# EAGLE design Heep32U4 (EAGLE 7.3.0)
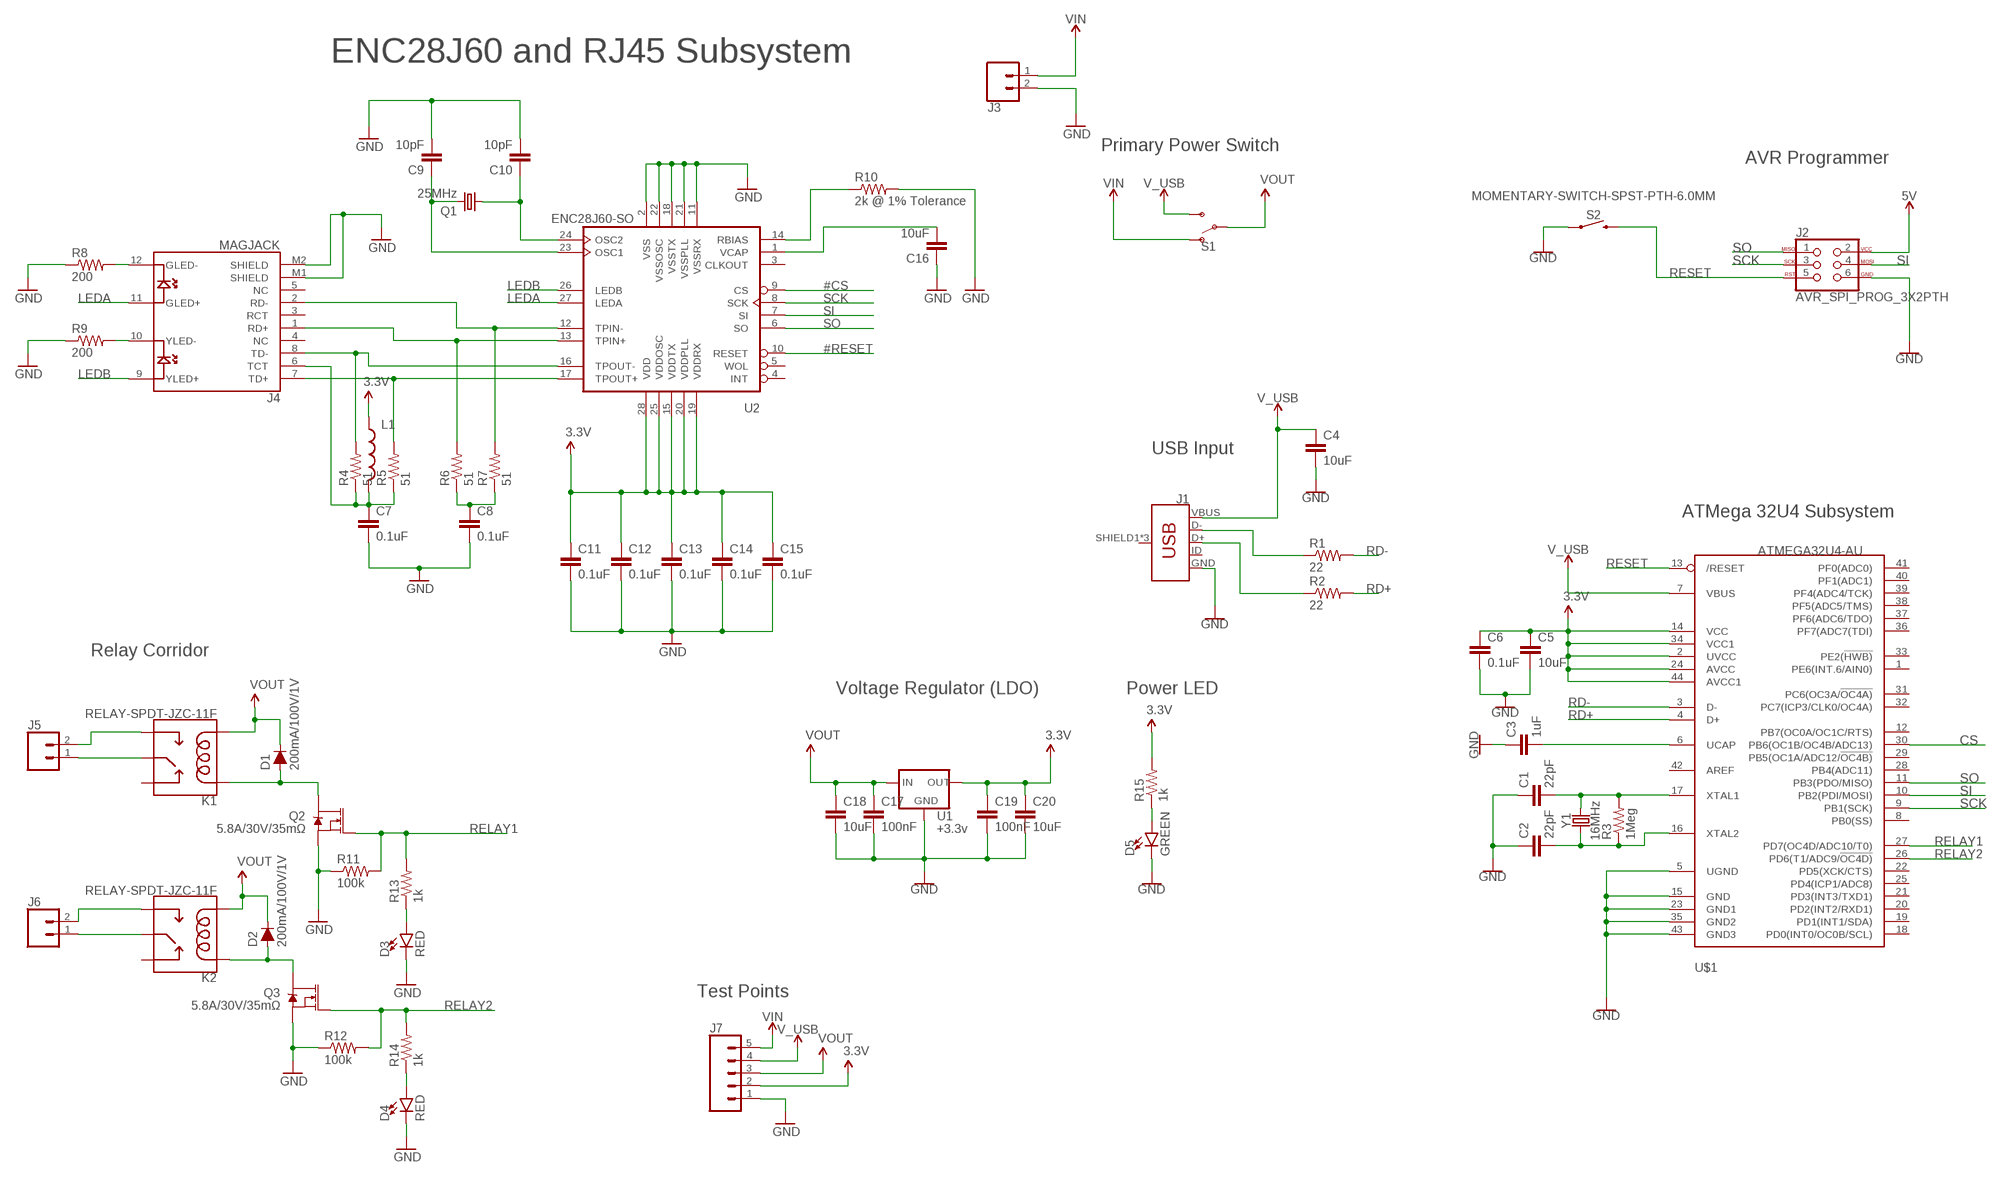
[diagram p0: schematic, sheet 1]

## Parts
C1  22pF  CAP0603-CAP  [0603-CAP]
C2  22pF  CAP0603-CAP  [0603-CAP]
C3  1uF  CAP0603-CAP  [0603-CAP]
C4  10uF  CAP0603-CAP  [0603-CAP]
C5  10uF  CAP0603-CAP  [0603-CAP]
C6  0.1uF  CAP0603-CAP  [0603-CAP]
C7  0.1uF  CAP0603-CAP  [0603-CAP]
C8  0.1uF  CAP0603-CAP  [0603-CAP]
C9  10pF  CAP0603-CAP  [0603-CAP]
C10  10pF  CAP0603-CAP  [0603-CAP]
C11  0.1uF  CAP0603-CAP  [0603-CAP]
C12  0.1uF  CAP0603-CAP  [0603-CAP]
C13  0.1uF  CAP0603-CAP  [0603-CAP]
C14  0.1uF  CAP0603-CAP  [0603-CAP]
C15  0.1uF  CAP0603-CAP  [0603-CAP]
C16  10uF  CAP0603-CAP  [0603-CAP]
C17  100nF  CAP0603-CAP  [0603-CAP]
C18  10uF  CAP0603-CAP  [0603-CAP]
C19  100nF  CAP0603-CAP  [0603-CAP]
C20  10uF  CAP0603-CAP  [0603-CAP]
D1  200mA/100V/1V  DIODE-1N4148  [DIODE-1N4148]
D2  200mA/100V/1V  DIODE-1N4148  [DIODE-1N4148]
D3  RED  LED-RED0603  [LED-0603]
D4  RED  LED-RED0603  [LED-0603]
D5  GREEN  LED-GREEN0603  [LED-0603]
J1  USB_MICRO-B_FEMALE-SMT  [USB-B-MICRO-SMD]
J2  AVR_SPI_PROG_3X2PTH  [2X3]
J3  CONN_02  [1X02]
J4  MAGJACK  [MAGJACK]
J5  CONN_025MM  [SCREWTERMINAL-5MM-2]
J6  CONN_025MM  [SCREWTERMINAL-5MM-2]
J7  CONN_05  [1X05]
K1  RELAY-SPDT-JZC-11F  [RELAY-JZC]
K2  RELAY-SPDT-JZC-11F  [RELAY-JZC]
L1  INDUCTOR0603  [0603]
Q1  25MHz  CRYSTALSM49  [SM49]
Q2  5.8A/30V/35mΩ  MOSFET-NCH-AO3404A  [SOT23-3]
Q3  5.8A/30V/35mΩ  MOSFET-NCH-AO3404A  [SOT23-3]
R1  22  RESISTOR0603-RES  [0603-RES]
R2  22  RESISTOR0603-RES  [0603-RES]
R3  1Meg  RESISTOR0603-RES  [0603-RES]
R4  51  RESISTOR0603  [0603-RES]
R5  51  RESISTOR0603  [0603-RES]
R6  51  RESISTOR0603  [0603-RES]
R7  51  RESISTOR0603  [0603-RES]
R8  200  RESISTOR0603  [0603-RES]
R9  200  RESISTOR0603  [0603-RES]
R10  2k @ 1% Tolerance  RESISTOR0603-RES  [0603-RES]
R11  100k  RESISTOR0603-RES  [0603-RES]
R12  100k  RESISTOR0603-RES  [0603-RES]
R13  1k  RESISTOR0603-RES  [0603-RES]
R14  1k  RESISTOR0603-RES  [0603-RES]
R15  1k  RESISTOR0603-RES  [0603-RES]
S1  SWITCH-SPDT-PTH-11.6X4.0MM  [SWITCH_SPDT_PTH_11.6X4.0MM]
S2  MOMENTARY-SWITCH-SPST-PTH-6.0MM  [TACTILE_SWITCH_PTH_6.0MM]
U1  +3.3v  V_REG_78XX7812  [TO-252]
U2  ENC28J60-SO  [SO28W]
U$1  ATMEGA32U4-AU  [TQFP44]
Y1  16MHz  CRYSTALSMD-HC49UP  [HC49UP]

## Nets
3.3V: C5.1 C6.1 C11.1 C12.1 C13.1 C14.1 C15.1 C19.1 C20.1 J7.2 L1.1 R15.2 U1.2(OUT) U2.15(VDDTX) U2.19(VDDRX) U2.20(VDDPLL) U2.25(VDDOSC) U2.28(VDD) U$1.2(UVCC) U$1.14(VCC) U$1.24(AVCC) U$1.34(VCC1) U$1.44(AVCC1)
5V: J2.2
#CS: U2.9(CS)
#RESET: U2.10(RESET)
CS: U$1.30(PB6(OC1B/OC4B/ADC13))
GND: C1.1 C2.1 C3.1 C4.2 C5.2 C6.2 C7.2 C8.2 C9.2 C10.2 C11.2 C12.2 C13.2 C14.2 C15.2 C16.1 C17.2 C18.2 C19.2 C20.2 D3.C D4.C D5.C J1.GND J2.6 J3.2 J4.M1(SHIELD) J4.M2(SHIELD) J7.1 Q2.2(S) Q3.2(S) R8.1 R9.1 R10.2 R11.1 R12.1 S2.1 U1.3(GND) U2.2(VSS) U2.11(VSSRX) U2.18(VSSTX) U2.21(VSSPLL) U2.22(VSSOSC) U$1.5(UGND) U$1.15(GND) U$1.23(GND1) U$1.35(GND2) U$1.43(GND3)
LEDA: J4.11(GLED+) U2.27(LEDA)
LEDB: J4.9(YLED+) U2.26(LEDB)
N$1: C3.2 U$1.6(UCAP)
N$2: J4.1(RD+) R6.2 U2.13(TPIN+)
N$3: J1.D- R1.1
N$4: J1.D+ R2.1
N$5: J4.2(RD-) R7.2 U2.12(TPIN-)
N$6: J4.8(TD-) R4.2 U2.16(TPOUT-)
N$7: J4.7(TD+) R5.2 U2.17(TPOUT+)
N$8: C8.1 R6.1 R7.1
N$9: C1.2 R3.2 U$1.17(XTAL1) Y1.2
N$10: C2.2 R3.1 U$1.16(XTAL2) Y1.1
N$11: C7.1 J4.6(TCT) L1.2 R4.1 R5.1
N$12: J4.10(YLED-) R9.2
N$13: J4.12(GLED-) R8.2
N$14: C9.1 Q1.2 U2.23(OSC1)
N$15: C10.1 Q1.1 U2.24(OSC2)
N$16: R10.1 U2.14(RBIAS)
N$17: C16.2 U2.1(VCAP)
N$18: J5.2 K1.3(NO)
N$19: J5.1 K1.4(MAIN)
N$20: J6.2 K2.3(NO)
N$21: J6.1 K2.4(MAIN)
N$22: D2.A K2.5(COIL1) Q3.3(D)
N$23: D1.A K1.5(COIL1) Q2.3(D)
N$24: D5.A R15.1
N$32: D4.A R14.1
N$33: D3.A R13.1
RD+: R2.2 U$1.4(D+)
RD-: R1.2 U$1.3(D-)
RELAY1: Q2.1(G) R11.2 R13.2 U$1.27(PD7(OC4D/ADC10/T0))
RELAY2: Q3.1(G) R12.2 R14.2 U$1.26(PD6(T1/ADC9/!OC4D))
RESET: J2.5 S2.3 U$1.13(/RESET)
SCK: J2.3 U2.8(SCK) U$1.9(PB1(SCK))
SI: J2.4 U2.7(SI) U$1.10(PB2(PDI/MOSI))
SO: J2.1 U2.6(SO) U$1.11(PB3(PDO/MISO))
V_USB: C4.1 J1.VBUS J7.4 S1.3(S) U$1.7(VBUS)
VIN: J3.1 J7.5 S1.1(O)
VOUT: C17.1 C18.1 D1.C D2.C J7.3 K1.1(COIL2) K2.1(COIL2) S1.2(P) U1.1(IN)
Unconnected: J1.ID J1.SHIELD1(SHIELD) J1.SHIELD2(SHIELD) J1.SHIELD3(SHIELD) J4.3(RCT) J4.4(NC) J4.5(NC) K1.2(NC) K2.2(NC) U2.3(CLKOUT) U2.4(INT) U2.5(WOL) U$1.1(PE6(INT.6/AIN0)) U$1.8(PB0(SS)) U$1.12(PB7(OC0A/OC1C/RTS)) U$1.18(PD0(INT0/OC0B/SCL)) U$1.19(PD1(INT1/SDA)) U$1.20(PD2(INT2/RXD1)) U$1.21(PD3(INT3/TXD1)) U$1.22(PD5(XCK/CTS)) U$1.25(PD4(ICP1/ADC8)) U$1.28(PB4(ADC11)) U$1.29(PB5(OC1A/ADC12/!OC4B)) U$1.31(PC6(OC3A/!OC4A)) U$1.32(PC7(ICP3/CLK0/OC4A)) U$1.33(PE2(!HWB)) U$1.36(PF7(ADC7(TDI)) U$1.37(PF6(ADC6/TDO)) U$1.38(PF5(ADC5/TMS)) U$1.39(PF4(ADC4/TCK)) U$1.40(PF1(ADC1)) U$1.41(PF0(ADC0)) U$1.42(AREF)

## Notes on the sheet
- ENC28J60 and RJ45 Subsystem
- Primary Power Switch
- AVR Programmer
- USB Input
- ATMega 32U4 Subsystem
- Relay Corridor
- Voltage Regulator (LDO) | Power LED
- Test Points

## Library data of the parts
C1-C6 C9 C10 C16-C20 = SparkFun-Passives:CAP: Capacitor Standard 0603 ceramic capacitor, and 0.1" leaded capacitor.
C7 C8 C11-C15 = SparkFun-Capacitors:CAP: Capacitor Standard 0603 ceramic capacitor, and 0.1" leaded capacitor.
D1 D2 = SparkFun-DiscreteSemi:DIODE: Diode These are standard reverse protection diodes and small signal diodes. SparkFun Products: SparkFun SparkPunk Sound Kit <https://www.sparkfun.com/products/11177> SparkFun ESP8266 Thing <https://www.sparkfun.com/products/13231>; PROD_ID: DIO-08378
D3 D4 = SparkFun-LED:LED-RED: Red SMD LED Used in manufacturing of most products at SparkFun Packages: 0603 - SMD 0603 package [Product Link] <http://docs.avagotech.com/docs/AV02-0551EN> 0603 SMART - SMD 0603 SMART package ( more efficient and expensive)[Product Link] <http://www.osram-os.com/Graphics/XPic2/00077099_0.pdf> 1206 - SMD1206 package [Product Link] <https://www.sparkfun.com/datasheets/DevTools/LilyPad/Q150OVS4.pdff> SparkFun Products: Pro Mini 328 -5V <https://www.sparkfun.com/products/821> RedBoard <https://www.sparkfun.com/products/12757> IOIO-OTG <https://www.sparkfun.com/products/13613>; PROD_ID: DIO-00819
D5 = SparkFun-LED:LED-GREEN: Green SMD LED Used in manufacturing of various products at SparkFun Packages: 0603 - SMD 0603 package [Product Link] <http://www.futureelectronics.com/en/technologies/semiconductors/optoelectronics/leds/Pages/9894312-LTST-C190GKT.aspx?CrossPart=HSMG-C190&IM=0> LilyPad 1206 - SMD1206 LilyPad package [Product Link] <http://www.futureelectronics.com/en/Technologies/Product.aspx?ProductID=IN150NGHARVATEKCORPORATION2049943&IM=0> 1206 - SMD1206 package [Product Link] <http://www.futureelectronics.com/en/technologies/semiconductors/optoelectronics/leds/Pages/8315665-LTST-C150KGKT.aspx?IM=0> 1206 Bottom Mount -SMD 1206 Bottom Mount [Product Link] <http://www.digikey.com/product-detail/en/lite-on-inc/LTST-C230KGKT/160-1456-1-ND/386854> SparkFun Products: Pro Mini 328 -5V <https://www.sparkfun.com/products/821> RedBoard <https://www.sparkfun.com/products/12757> MP3 Trigger <https://www.sparkfun.com/products/13720> Makey Makey <https://www.sparkfun.com/products/11076>; PROD_ID: DIO-00821
J1 = SparkFun-Connectors:USB_MICRO-B: USB Type Micro-B Connector Male/female and PTH/SMT variants SparkFun Products: SparkFun microB USB Breakout <https://www.sparkfun.com/products/12035> SparkFun USB microB Plug Breakout <https://www.sparkfun.com/products/10031> SparkFun ESP8266 Thing <https://www.sparkfun.com/products/13231>; PROD_ID: CONN-11752
J2 = SparkFun-Connectors:AVR_SPI_PROG_3X2: AVR ISP 6 Pin This is the reduced ISP connector for AVR programming. Common on Arduino. This footprint will take up less PCB space and can be used with a 10-pin to 6-pin adapter such as SKU: BOB-08508 **Special note about "TEST_POINT" package. The stop mask is on the top side, so if you want your programming test points to be on the bottom of your board, make sure to place this package on the bottom side of the board. This also ensure that the orientation to program from the bottom side will be correct. SparkFun Products: SparkFun ISP Pogo Adapter <https://www.sparkfun.com/products/11591> - NS Tiny AVR Programmer <https://www.sparkfun.com/products/11801> -PTH
J3 = SparkFun-Connectors:CONN_02: Multi connection point. Often used as Generic Header-pin footprint for 0.1 inch spaced/style header connections On any of the 0.1 inch spaced packages, you can populate with these: Break Away Headers - Straight <https://www.sparkfun.com/products/116> (PRT-00116) Break Away Male Headers - Right Angle <https://www.sparkfun.com/products/553> (PRT-00553) Female Headers <https://www.sparkfun.com/products/115> (PRT-00115) Break Away Headers - Machine Pin <https://www.sparkfun.com/products/117> (PRT-00117) Break Away Female Headers - Swiss Machine Pin <https://www.sparkfun.com/products/743> (PRT-00743) For SCREWTERMINALS and SPRING TERMINALS visit here: Screw Terimnals on SparkFun.com <https://www.sparkfun.com/search/results?term=Screw+Terminals> (5mm/3.5mm/2.54mm spacing) This device is also useful as a general connection point to wire up your design to another part of your project. Our various solder wires solder well into these plated through hole pads. Hook-Up Wire - Assortment (Stranded, 22 AWG) <https://www.sparkfun.com/products/11375> (PRT-11375) Hook-Up Wire - Assortment (Solid Core, 22 AWG) <https://www.sparkfun.com/products/11367> (PRT-11367) View the entire wire category on our website here <https://www.sparkfun.com/categories/141> Special notes: Molex polarized connector foot print use with: PRT-08233 with associated crimp pins and housings. 2.54_SCREWTERM for use with PRT-10571. 3.5mm Screw Terminal footprints for PRT-08084 5mm Screw Terminal footprints for use with PRT-08432
J4 = SparkFun-Connectors:MAGJACK: MAGJACK: RJ-45 with LEDs This is a single port, RJ45 ethernet jacks with built in transformer (magnetics), status LEDs, and shielding. Here is the connector we sell at SparkFun: RJ45 Ethernet MagJack-Compatible <https://www.sparkfun.com/products/8534> (PRT-08534) Datasheet <http://www.sparkfun.com/datasheets/Prototyping/MagJack.pdf> It is used on this SparkFun product: SparkFun RJ45 MagJack Breakout <https://www.sparkfun.com/products/13021> (BOB-13021); PROD_ID: CONN-09556; SF_ID: PRT-08534
J5 J6 = SparkFun-Connectors:CONN_02: Multi connection point. Often used as Generic Header-pin footprint for 0.1 inch spaced/style header connections On any of the 0.1 inch spaced packages, you can populate with these: Break Away Headers - Straight <https://www.sparkfun.com/products/116> (PRT-00116) Break Away Male Headers - Right Angle <https://www.sparkfun.com/products/553> (PRT-00553) Female Headers <https://www.sparkfun.com/products/115> (PRT-00115) Break Away Headers - Machine Pin <https://www.sparkfun.com/products/117> (PRT-00117) Break Away Female Headers - Swiss Machine Pin <https://www.sparkfun.com/products/743> (PRT-00743) For SCREWTERMINALS and SPRING TERMINALS visit here: Screw Terimnals on SparkFun.com <https://www.sparkfun.com/search/results?term=Screw+Terminals> (5mm/3.5mm/2.54mm spacing) This device is also useful as a general connection point to wire up your design to another part of your project. Our various solder wires solder well into these plated through hole pads. Hook-Up Wire - Assortment (Stranded, 22 AWG) <https://www.sparkfun.com/products/11375> (PRT-11375) Hook-Up Wire - Assortment (Solid Core, 22 AWG) <https://www.sparkfun.com/products/11367> (PRT-11367) View the entire wire category on our website here <https://www.sparkfun.com/categories/141> Special notes: Molex polarized connector foot print use with: PRT-08233 with associated crimp pins and housings. 2.54_SCREWTERM for use with PRT-10571. 3.5mm Screw Terminal footprints for PRT-08084 5mm Screw Terminal footprints for use with PRT-08432; SF_SKU: PRT-08432
J7 = SparkFun-Connectors:CONN_05: Multi connection point. Often used as Generic Header-pin footprint for 0.1 inch spaced/style header connections On any of the 0.1 inch spaced packages, you can populate with these: Break Away Headers - Straight <https://www.sparkfun.com/products/116> (PRT-00116) Break Away Male Headers - Right Angle <https://www.sparkfun.com/products/553> (PRT-00553) Female Headers <https://www.sparkfun.com/products/115> (PRT-00115) Break Away Headers - Machine Pin <https://www.sparkfun.com/products/117> (PRT-00117) Break Away Female Headers - Swiss Machine Pin <https://www.sparkfun.com/products/743> (PRT-00743) For SCREWTERMINALS and SPRING TERMINALS visit here: Screw Terimnals on SparkFun.com <https://www.sparkfun.com/search/results?term=Screw+Terminals> (5mm/3.5mm/2.54mm spacing) This device is also useful as a general connection point to wire up your design to another part of your project. Our various solder wires solder well into these plated through hole pads. Hook-Up Wire - Assortment (Stranded, 22 AWG) <https://www.sparkfun.com/products/11375> (PRT-11375) Hook-Up Wire - Assortment (Solid Core, 22 AWG) <https://www.sparkfun.com/products/11367> (PRT-11367) View the entire wire category on our website here <https://www.sparkfun.com/categories/141> Special notes: Molex polarized connector foot print use with SKU : PRT-08231 with associated crimp pins and housings. 1MM SMD Version SKU: PRT-10208
K1 K2 = SparkFun-Electromechanical:RELAY-SPDT: SPDT Electromechanical Relay Single-pole, double-throw sealed relays. When current is applied to the coil, it throws a simple changeover switch, terminating the connection from the NC contact to ground and closing the NO contact. Use them to switch high voltage/high current devices. SparkFun Products JQX-15F: Relay SPDT Sealed - 20A <https://www.sparkfun.com/products/10924> (COM-10924) JZC-11F: Relay SPDT Sealed <https://www.sparkfun.com/products/100> (COM-00100); PROD_ID: COMP-09533; SF_SKU: COM-00100
L1 = SparkFun-Passives:INDUCTOR: Inductors Basic Inductor/Choke - 0603 and 1206. Footprints are not proven and vary greatly between part numbers. INDUCTOR POWER 3.3UH 4.0A SMD 0.197" L x 0.197" W x 0.177" H (5.00mm x 5.00mm x 4.50mm)
Q1 = adafruit:CRYSTAL: CRYSTAL; OC_FARNELL: unknown; OC_NEWARK: unknown
Q2 Q3 = SparkFun-DiscreteSemi:MOSFET-NCH: N-channel MOSFETs Voltage controlled devices that allow control of high current outputs. SparkFun Products: SparkFun OpenScale <https://www.sparkfun.com/products/13261> SparkFun Digital Sandbox <https://www.sparkfun.com/products/12651> SparkFun Monster Moto Shield <https://www.sparkfun.com/products/10182> SparkFun MOSFET Power Controller <https://www.sparkfun.com/products/11214>; PROD_ID: TRANS-12988
R1-R3 R10-R15 = SparkFun-Passives:RESISTOR: Resistor Basic schematic elements and footprints for 0603, 1206, and PTH resistors.
R4-R9 = SparkFun-Resistors:RESISTOR: Resistor Basic schematic elements and footprints for 0603, 1206, and PTH resistors.
S1 = SparkFun-Switches:SWITCH-SPDT: Single Pole, Double Throw (SPDT) Switch Single-pole, double-throw (SPDT) switch. Variant Overview SMD-AYZ0202 Surface Mount DPDT Switch <https://www.sparkfun.com/products/597> (COM-00597) Used on e.g. LilyPad Arduino USB - ATmega32U4 Board <https://www.sparkfun.com/products/12049> PTH-11.6X4.0MM SPDT Mini Power Switch <https://www.sparkfun.com/products/102> (COM-00102) Used on e.g. SparkFun Simon Says - Through-Hole Soldering Kit <https://www.sparkfun.com/products/10547> (KIT-10547) PTH-11.6X4.0MM-KIT KIT version of SPDT Mini Power Switch - Simplifies soldering by removing tStop of switch pins - only one side can be soldered. PTH-11.6X4.0MM-LOCK LOCK version of SPDT Mini Power Switch - Offset pins hold switch in place for easier soldering. SMD-RIGHT-ANGLE Surface Mount Right Angle Switch <https://www.sparkfun.com/products/10860> (COM-10860) Used on e.g. SparkFun ESP8266 Thing <https://www.sparkfun.com/products/13231>; PROD_ID: SWCH-08261; SF_SKU: COM-00102
S2 = SparkFun-Switches:MOMENTARY-SWITCH-SPST: Momentary Switch (Pushbutton) - SPST Normally-open (NO) SPST momentary switches (buttons, pushbuttons). Variants PTH-12MM - 12mm square, through-hole Momentary Pushbutton Switch - 12mm Square <https://www.sparkfun.com/products/9190> (COM-09190) PTH-6.0MM, PTH-6.0MM-KIT - 6.0mm square, through-hole Mini Pushbutton Switch <https://www.sparkfun.com/products/97> (COM-00097) KIT package intended for soldering kit's - only one side of pads' copper is exposed. PTH-RIGHT-ANGLE-KIT - Right-angle, through-hole Right Angle Tactile Button <https://www.sparkfun.com/products/10791> - Used on SparkFun BigTime Watch Kit <https://www.sparkfun.com/products/11734> SMD-12MM - 12mm square, surface-mount Tactile Button - SMD (12mm) <https://www.sparkfun.com/products/12993> (COM-12993) Used on SparkFun PicoBoard <https://www.sparkfun.com/products/11888> SMD-4.5MM - 4.5mm Square Trackball Switch Used on SparkFun Blackberry Trackballer Breakout <https://www.sparkfun.com/products/13169> SMD-4.6MMX2.8MM - 4.60mm x 2.80mm, surface mount Used on SparkFun SAMD21 Mini Breakout <https://www.sparkfun.com/products/13664> SMD-5.2MM, SMD-5.2-REDUNDANT - 5.2mm square, surface-mount Mini Pushbutton Switch - SMD <https://www.sparkfun.com/products/8720> (COM-08720) Used on Arduino Pro Mini <https://www.sparkfun.com/products/11114> REDUNDANT package connects both switch circuits together SMD-6.0X3.5MM - 6.0 x 3.5mm, surface mount Momentary Reset Switch SMD <https://www.sparkfun.com/products/8229> (COM-08229) SMD-6.2MM-TALL - 6.2mm square, surface mount Tactile Button - SMD (6mm) <https://www.sparkfun.com/products/12992> Used on SparkFun Digital Sandbox <https://www.sparkfun.com/products/12651> SMD-RIGHT-ANGLE - Right-angle, surface mount Used on SparkFun Block for Intel® Edison - Arduino <https://www.sparkfun.com/products/13036>; PROD_ID: SWCH-08441; SF_SKU: COM-00097
U1 = SparkFun-IC-Power:V_REG_78XX: Voltage Regulator Standard 78xx regulator. IGO (Input Ground Output). Spark Fun Electronics SKU : COM-00107; PROD_ID: VREG-12370; VALUE: +12v
U2 = microchip-enc28j60:ENC28J60-*: Microchip 10Mbit Eth. contoller with SPI interface
U$1 = adafruit:ATMEGA32U4: http://www.ladyada.net/library/eagle
Y1 = SparkFun-Clocks:CRYSTAL: Crystals (Generic) These are passive quartz crystals, which can be used as a clock source for a microcontroller. Crystal's are two-terminal devices. They require external "load" capacitors to generate an oscillating signal.

## Board
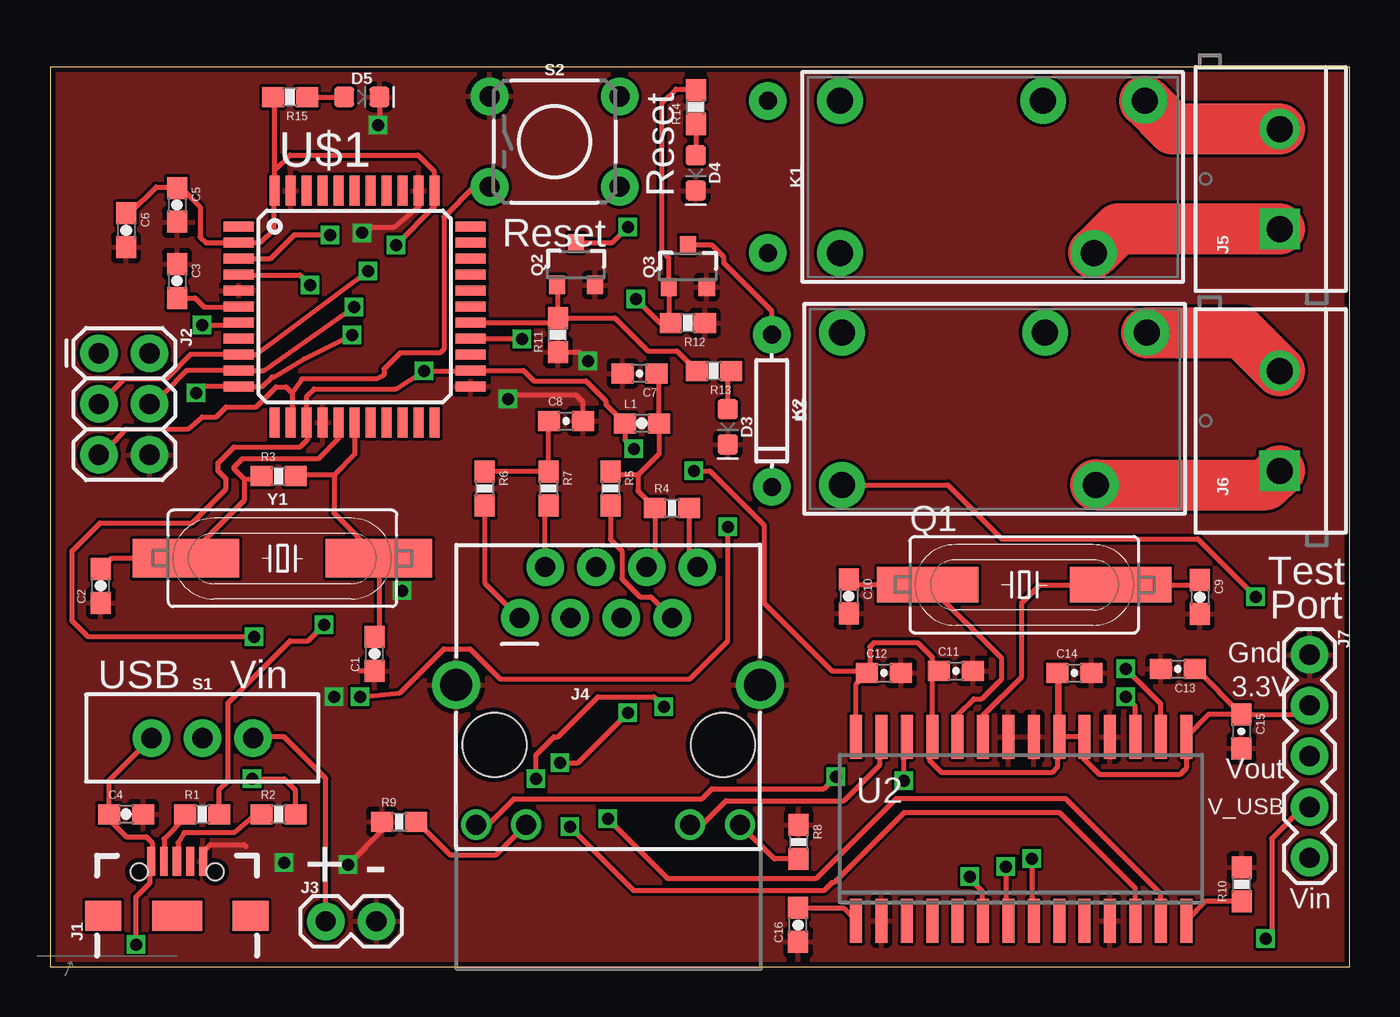
[diagram p1: board, top side]
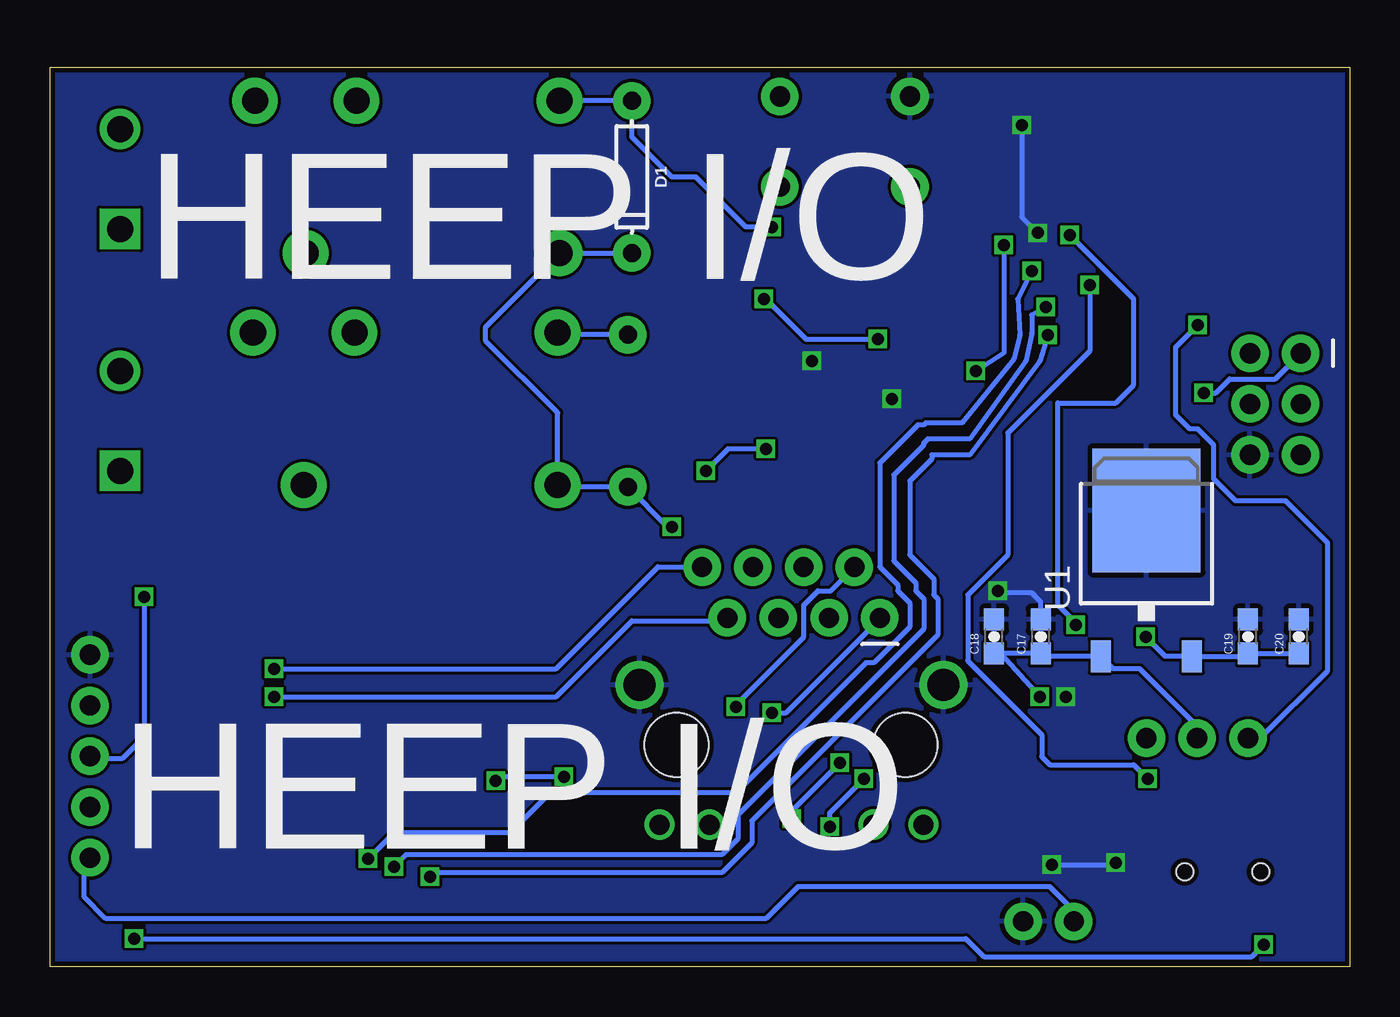
[diagram p2: board, bottom side, seen from below]

Size 65 x 45 mm. Coordinates in mm from the lower left corner, seen from the top.
Outline: 0,0 65,0 65,45 0,45 0,0
Copper layers (1*16): Top 0.035mm / dielectric 1.5mm / Bottom 0.035mm
Design rules "SeeedStudio_2layer_DRU_no_angle_20140221": minimum track width 6mil, minimum drill 12mil, track to track 6mil, track to pad 6mil, pad to pad 6mil, via to via 6mil, smd to smd 0mil, copper to edge 10mil, drill to drill 10mil, minimum pad ring 10mil, minimum via ring 6mil, stop-mask expansion 2mil, vias tented up to drill 100mil, thermal gap 10mil

### Footprints (pad centres in the part's own frame; a part is rotated, then mirrored left to right if it is on the bottom)
0603-CAP = smd 1.1 x 1: 1 -0.85,0; 2 0.85,0
DIODE-1N4148 = drill 0.9 pad 1.88: A -3.81,0; C 3.81,0
LED-0603 = smd 1 x 1: A -0.877,0; C 0.877,0
USB-B-MICRO-SMD = smd 1.45 x 0.4: D+ 2.725,0; D- 2.725,0.65; GND 2.725,-1.3; ID 2.725,-0.65; VBUS 2.725,1.3 | smd 1.5 x 1.8: SHIELD1 0,3.685; SHIELD2 0,-3.685 | smd 1.5 x 2.5: SHIELD3 0,0 | hole 0.85: 2.2,1.9; 2.2,-1.9
2X3 = drill 1.016 pad 1.88: 1 0,0; 2 0,2.54; 3 2.54,0; 4 2.54,2.54; 5 5.08,0; 6 5.08,2.54
1X02 = drill 1.016 pad 1.88: 1 0,0; 2 2.54,0
MAGJACK = drill 1 pad 1.88: 1 3.175,17.445; 2 4.445,19.985; 3 5.715,17.445; 4 6.985,19.985; 5 8.255,17.445; 6 9.525,19.985; 7 10.795,17.445; 8 12.065,19.985 | drill 1 pad 1.27: 9 1,7.1; 10 3.5,7.1; 11 11.7,7.1; 12 14.2,7.1 | drill 1.6 pad 2.184: M1 0,14.1; M2 15.2,14.1 | hole 3.2: 1.905,11.095; 13.335,11.095
SCREWTERMINAL-5MM-2 = drill 1.3 pad 2.032 square: 1 0,0 | drill 1.3 pad 2.032: 2 5,0
1X05 = drill 1.016 pad 1.88: 1 0,0; 2 2.54,0; 3 5.08,0; 4 7.62,0; 5 10.16,0
RELAY-JZC = drill 1.3 pad 2.286: 1 3.81,-8.89; 2 -3.81,1.27; 3 -3.81,6.35; 4 3.81,3.81; 5 -3.81,-8.89
0603 = smd 1.1 x 1: 1 -0.85,0; 2 0.85,0
SM49 = smd 5.08 x 1.778: 1 -4.826,0; 2 4.826,0
SOT23-3 = smd 0.8 x 0.9: 1 -0.95,-1; 2 0.95,-1; 3 0,1.1
0603-RES = smd 1.1 x 1: 1 -0.85,0; 2 0.85,0
SWITCH_SPDT_PTH_11.6X4.0MM = drill 1.016 pad 1.88: 1 0,2.54; 2 0,0; 3 0,-2.54
TACTILE_SWITCH_PTH_6.0MM = drill 1.016 pad 1.88: 1 -3.251,2.261; 2 3.251,2.261; 3 -3.251,-2.261; 4 3.251,-2.261
TO-252 = smd 1 x 1.6: 1 -2.28,-4.8; 2 2.28,-4.8 | smd 5.4 x 6.2: 3 0,2.5
SO28W = smd 0.6 x 2.2: 1 -8.255,-4.6; 2 -6.985,-4.6; 3 -5.715,-4.6; 4 -4.445,-4.6; 5 -3.175,-4.6; 6 -1.905,-4.6; 7 -0.635,-4.6; 8 0.635,-4.6; 9 1.905,-4.6; 10 3.175,-4.6; 11 4.445,-4.6; 12 5.715,-4.6; 13 6.985,-4.6; 14 8.255,-4.6; 15 8.255,4.6; 16 6.985,4.6; 17 5.715,4.6; 18 4.445,4.6; 19 3.175,4.6; 20 1.905,4.6; 21 0.635,4.6; 22 -0.635,4.6; 23 -1.905,4.6; 24 -3.175,4.6; 25 -4.445,4.6; 26 -5.715,4.6; 27 -6.985,4.6; 28 -8.255,4.6
TQFP44 = smd 1.5 x 0.5: 1 -5.8,4; 2 -5.8,3.2; 3 -5.8,2.4; 4 -5.8,1.6; 5 -5.8,0.8; 6 -5.8,0; 7 -5.8,-0.8; 8 -5.8,-1.6; 9 -5.8,-2.4; 10 -5.8,-3.2; 11 -5.8,-4; 23 5.8,-4; 24 5.8,-3.2; 25 5.8,-2.4; 26 5.8,-1.6; 27 5.8,-0.8; 28 5.8,0; 29 5.8,0.8; 30 5.8,1.6; 31 5.8,2.4; 32 5.8,3.2; 33 5.8,4 | smd 0.5 x 1.5: 12 -4,-5.8; 13 -3.2,-5.8; 14 -2.4,-5.8; 15 -1.6,-5.8; 16 -0.8,-5.8; 17 0,-5.8; 18 0.8,-5.8; 19 1.6,-5.8; 20 2.4,-5.8; 21 3.2,-5.8; 22 4,-5.8; 34 4,5.8; 35 3.2,5.8; 36 2.4,5.8; 37 1.6,5.8; 38 0.8,5.8; 39 0,5.8; 40 -0.8,5.8; 41 -1.6,5.8; 42 -2.4,5.8; 43 -3.2,5.8; 44 -4,5.8
HC49UP = smd 5.334 x 1.93: 1 -4.826,0; 2 4.826,0

### Placement (x,y rotation side)
C1  16.24,15.64 90 top
C2  2.54,19.05 90 top
C3  6.35,34.29 270 top
C4  3.81,7.62 0 top
C5  6.35,38.1 270 top
C6  3.81,36.83 270 top
C7  29.49,29.67 180 top
C8  25.81,27.29 0 top
C9  57.51,18.48 270 top
C10  39.95,18.52 270 top
C11  45.31,14.78 0 top
C12  41.72,14.68 0 top
C13  56.42,14.88 180 top
C14  51.23,14.68 0 top
C15  59.59,11.77 270 top
C16  37.42,2.08 90 top
C17  15.44,16.51 90 bottom
C18  17.78,16.51 90 bottom
C19  5.08,16.51 90 bottom
C20  2.54,16.51 90 bottom
D1  35.9,39.5 270 bottom
D2  36.1,27.8 270 top
D3  33.9,27 270 top
D4  32.3,39.7 270 top
D5  15.6,43.5 0 top
J1  6.35,2.54 90 top
J2  2.44,30.68 270 top
J3  13.79,2.26 0 top
J4  20.32,0 0 top
J5  61.5,36.9 90 top
J6  61.5,24.8 90 top
J7  63,15.6 270 top
K1  48.4,39.5 270 top
K2  48.5,27.9 270 top
L1  29.6,27.17 0 top
Q1  48.73,19.1 0 top
Q2  26.3,35.1 0 top
Q3  31.9,35 0 top
R1  7.62,7.62 0 top
R2  11.43,7.62 0 top
R3  11.43,24.53 0 top
R4  31.11,22.94 0 top
R5  28.03,23.92 270 top
R6  21.74,23.91 270 top
R7  24.94,23.92 270 top
R8  37.44,6.23 270 top
R9  17.46,7.24 0 top
R10  59.61,4.11 90 top
R11  25.4,31.6 90 top
R12  31.9,32.2 180 top
R13  33.2,29.8 180 top
R14  32.3,43 90 top
R15  12,43.5 180 top
S1  7.62,11.43 270 top
S2  25.24,41.27 0 top
U1  10.16,20.32 0 bottom
U2  48.57,6.9 0 top
U$1  15.24,33.02 0 top
Y1  11.63,20.42 0 top

### Tracks (layer width: path | path; a pad name or v marks a point on that pad's centre or on a via)
3.3V  (via drill 0.6)
  Top 0.254: C6.1 3.98,37.68 5.3,39 6.3,39 C5.1 6.55,38.95 7.5,38 7.5,36.5 7.8,36.2 9.42,36.2 U$1.2 10.52,36.22 11.2,36.9 11.2,38.78 U$1.44 | U$1.44 11.24,43.41 R15.2 | U$1.44 11.24,39.84 12,40.6 18.4,40.6 19.2,39.8 19.2,38.86 U$1.34 19.24,38.04 v17.3,36.1 | v10.2,16.5 1.9,16.5 1.1,17.3 1.1,20.8 2.5,22.2 7.1,22.2 8.8,23.9 8.8,24.4 8.4,24.8 8.4,25.2 9.2,26 12.5,26 12.9,26.4 12.9,27.16 U$1.14 12.84,28.54 13.2,28.9 17.3,28.9 v18.7,29.8 21.02,29.8 U$1.24 23.68,29.82 24.2,29.3 26.8,29.3 27.8,28.3 27.8,28.12 L1.1 28.75,26.35 v29.2,25.9 | v32.2,24.8 33,24.8 35.7,22.1 35.7,18.2 39.1,14.8 40.75,14.8 C12.1 | U2.28 40.31,14.12 C12.1 | 44.12,14.45 U2.25 44,11.38 44,10.3 44.6,9.7 50.1,9.7 50.38,9.98 C14.1 50.48,14.59 U2.20 U2.19 51.7,11.46 51.7,10.4 52.5,9.6 56.5,9.6 56.83,9.93 U2.15 57.95,12.62 C15.1 | 44.12,14.45 C11.1 | C13.1 57.33,14.88 C15.1 | C15.1 62.56,12.62 J7.2 | 44.12,14.45 44.12,15.47 43.4,16.2 41.2,16.2 41,16 41,14.81 C12.1
  Bottom 0.254: C20.1 C19.1 5.22,15.52 U1.2 9.22,15.52 v10.2,16.5 | v17.3,36.1 17.3,30.7 v18.7,29.8 | v29.2,25.9 31.1,25.9 v32.2,24.8
GND  (via drill 0.6)
  Top 0.254: J1.GND 7.65,5.75 8,6.1 9.7,6.1 9.8,6 | C1.1 15.49,14.79 | R9.1 16.61,6.81 v14.9,5.1 | v11.7,5.2 11.7,5.4 11.6,5.5 | D5.C 16.48,42.18 v16.4,42.1 | v15.6,36.7 15.8,36.7 16.1,37 17.2,37 18.5,38.1 | C8.2 26.66,28.24 26.3,28.6 23.1,28.6 v22.9,28.4 | R11.1 26.45,30.75 v26.9,30.3 | v17.6,18.8 17.8,18.8
  Bottom 0.254: v14.2,13.5 14,13.5 | v14.9,5.1 12.1,5.1 12,5.2 v11.7,5.2 | v16.4,42.1 16.4,37.5 v15.6,36.7 | v22.9,28.4 23,28.3 | v26.9,30.3 27.1,30.3 | C17.2 15.44,18.24 15.9,18.7 17.5,18.7 v17.6,18.8
  pour Bottom: -20,50 -20,60 80,60 80,-20 -20,-20
  pour Top: -10,50 70,50 70,-10 -10,-10
LEDA
  Top 0.254: J4.11 32.6,7.1 33.8,8.3 39.7,8.3 41.5,10.1 41.5,11.41 U2.27
LEDB  (via drill 0.6)
  Top 0.254: J4.9 21.9,7.1 23.2,8.4 32.6,8.4 33.1,8.9 38.7,8.9 v39.3,9.5 | v42.7,9.3 42.7,11.35 U2.26
  Bottom 0.254: v39.3,9.5 42.5,9.5 v42.7,9.3
N$1
  Top 0.254: C3.2 7.26,33.44 7.7,33 9.42,33 U$1.6
N$2  (via drill 0.6)
  Top 0.254: R6.2 21.74,19.2 J4.1 | U2.13 55.55,3.65 50.8,8.4 42.3,8.4 38.3,4.4 30.9,4.4 v27.9,7.4 | v25.5,10.2 26.4,10.2 v28.9,12.7
  Bottom 0.254: v27.9,7.4 27.9,7.8 v25.5,10.2 | v28.9,12.7 28.2,12.7 23.9,17 23.9,17.04 J4.1
N$3
  Top 0.254: R1.1 6.77,7.47 5.7,6.4 J1.D-
N$4
  Top 0.254: R2.1 10.32,7.62 9.2,6.7 6.7,6.7 6.4,6.2 6.4,5.32 J1.D+
N$5  (via drill 0.6)
  Top 0.254: J4.2 24.77,22.89 R7.2 | U2.12 54.28,3.92 50.5,7.7 42.7,7.7 39.2,4.2 39.1,4.2 38.7,3.8 29.2,3.8 v26,7 | v24.3,9.4 24.3,10.6 25.2,11.5 25.4,11.5 27.4,13.5 30.2,13.5 v30.7,13
  Bottom 0.254: v26,7 26,7.7 v24.3,9.4 | v30.7,13 30.7,13.1 27.3,16.5 27.3,18.1 26.6,18.8 25.95,18.8 J4.2
N$6  (via drill 0.6)
  Top 0.254: R4.2 31.96,20.41 J4.8 | U2.16 55.55,13.14 v53.8,14.9
  Bottom 0.254: v53.8,14.9 39.7,14.9 34.6,20 32.4,20 J4.8
N$7  (via drill 0.6)
  Top 0.254: R5.2 28.03,21.37 28.6,20.8 28.6,19.4 29.5,18.5 30.06,18.5 J4.7 | U2.17 54.28,13.02 v53.8,13.5
  Bottom 0.254: v53.8,13.5 39.7,13.5 35.9,17.3 31.26,17.3 J4.7
N$8
  Top 0.254: R6.1 R7.1 24.94,27.27 C8.1
N$9
  Top 0.254: U$1.17 15.24,25.64 14.2,24.6 | 14.2,24.6 12.35,24.6 R3.2 | 14.2,24.6 14.2,22.68 Y1.2 16.46,16.71 C1.2
N$10
  Top 0.254: U$1.16 14.44,26.44 13.4,25.4 9.6,25.4 9.2,25 9.2,24.9 9.7,24.4 | 9.7,24.4 10.45,24.4 R3.1 | 9.7,24.4 9.7,23.32 Y1.1 3.06,20.42 C2.2
N$11
  Top 0.254: C7.1 30.45,29.56 L1.2 30.45,25.65 29.4,24.6 | 29.4,24.6 28.2,24.6 R5.1 | J4.6 30.26,20.4 R4.1 29.4,23.8 29.4,24.6
N$12
  Top 0.254: R9.2 18.36,7.24 20,5.6 22.32,5.6 J4.10
N$13
  Top 0.254: R8.2 36.24,5.38 J4.12
N$14
  Top 0.254: C9.1 57.28,19.1 Q1.2 49.5,19.1 48.6,18.2 48.6,14.5 46.66,12.56 U2.23
N$15
  Top 0.254: C10.1 40.22,19.1 Q1.1 47.6,15.4 47.6,14.4 46.6,13.4 46.2,13.4 45.4,12.6 U2.24
N$16
  Top 0.254: R10.1 57.78,3.26 U2.14
N$17
  Top 0.254: C16.2 39.69,2.93 U2.1
N$18
  Top 2.54: J5.2 56.16,41.9 K1.3
N$19
  Top 2.54: J5.1 53.42,36.9 K1.4
N$20
  Top 2.54: K2.3 59.59,31.71 J6.2
N$21
  Top 2.54: K2.4 60.79,24.09 J6.1
N$22
  Top 0.254: D2.A 36.1,32.8 33.7,35.2 33.7,35.5 33.1,36.1 Q3.3
  Bottom 0.254: D2.A 39.51,31.61 K2.5
N$23  (via drill 0.6)
  Top 0.254: Q2.3 28.1,36.2 v28.9,37
  Bottom 0.254: v28.9,37 30.2,37 32.7,39.5 33.9,39.5 35.9,41.5 D1.A K1.5
N$24
  Top 0.254: R15.1 D5.A
N$32
  Top 0.254: R14.1 D4.A
N$33
  Top 0.254: D3.A 33.9,29.65 R13.1
RD+  (via drill 0.6)
  Top 0.254: R2.2 12.28,8.82 11.7,9.4 v10.1,9.4 | U$1.4 9.46,34.6 12.5,34.6 v13,34.1
  Bottom 0.254: v13,34.1 13,30.8 17.1,26.7 17.1,20.6 19.1,18.6 19.1,15.3 15.4,11.6 15.4,10.5 15,10.1 10.8,10.1 v10.1,9.4
RD-  (via drill 0.6)
  Top 0.254: R1.2 8.47,8.87 8.9,9.3 8.9,13.2 12,16.3 12.9,16.3 v13.7,17.1 | v14,36.6 12.2,36.6 11,35.4 9.46,35.4 U$1.3
  Bottom 0.254: v13.7,17.1 13.7,17.2 14.6,18.1 14.6,28.2 11.7,28.2 10.8,29.1 10.8,33.4 v14,36.6
RELAY1
  Top 0.254: U$1.27 25.17,32.22 R11.2 | R11.2 25.4,34.05 Q2.1 | R11.2 28.25,32.45 29.9,30.8 31.35,30.8 R13.2
RELAY2  (via drill 0.6)
  Top 0.254: R14.2 32.25,43.9 31.3,43.9 30.6,43.2 30.6,35.8 30.95,35.45 Q3.1 30.95,32.3 R12.2 30.5,32.2 v29.3,33.4 | v23.6,31.4 21.06,31.4 U$1.26
  Bottom 0.254: v29.3,33.4 29.2,33.4 27.2,31.4 v23.6,31.4
RESET
  Top 0.254: J2.5 2.6,25.6 3.8,26.9 6.9,26.9 7.6,27.5 8.3,27.5 8.8,28 10.3,28 11.3,29 11.8,29 12.1,28.7 | 12.1,28.7 12.1,27.28 U$1.13 | S2.3 21.21,39.01 19.7,37.5 19.7,30.9 19.5,30.7 17.5,30.7 16.7,29.9 16.7,29.6 16.3,29.4 12.6,29.4 12.1,28.7
SCK  (via drill 0.6)
  Top 0.254: J2.3 3.7,29.4 5.8,29.4 7.02,30.62 U$1.9 10.32,30.62 v15.9,34.8 | v49.1,5.4 49.1,2.4 U2.8
  Bottom 0.254: v15.9,34.8 16.6,33.4 16.5,31.6 16.8,30.4 19.4,27.2 21.2,27.2 21.3,27.1 21.6,27.1 23.5,25.2 23.5,20 22.6,19.1 22.6,18.8 22,18.2 22,17 23.8,15.2 24.2,15.2 30.7,8.7 40,8.7 42,6.7 47.8,6.7 v49.1,5.4
SI  (via drill 0.6)
  Top 0.254: J2.4 5.54,28.7 5.7,28.7 6.82,29.82 U$1.10 10.72,29.82 v15.2,33 | v47.8,5 47.8,3 47.9,2.9 47.9,2.33 U2.7
  Bottom 0.254: v15.2,33 15.9,32.6 15.9,31.7 16.2,30.3 19,26.4 21.1,26.4 21.3,26.2 21.3,26.1 22.8,24.6 22.8,20.3 21.7,19.2 21.7,18.8 21.3,18.4 21.3,16.9 30.6,7.6 30.6,6.4 31.4,5.6 47.2,5.6 v47.8,5
SO  (via drill 0.6)
  Top 0.254: v7.3,28.7 7.62,29.02 U$1.11 10.62,29.02 11.1,29.5 11.2,29.5 12.7,30.4 v15.1,31.6 | v46,4.5 46,4.4 46.6,3.8 46.6,2.37 U2.6
  Bottom 0.254: v7.3,28.7 6.7,28.7 6,29.4 3.72,29.4 J2.1 | v15.1,31.6 15.5,30.3 19,25.6 20.9,25.6 20.9,25.4 22,24.3 22,20.6 20.8,19.4 20.8,18.6 20.6,18.4 20.6,16.6 29.9,7.3 29.9,6.2 31.4,4.7 45.8,4.7 v46,4.5
V_USB  (via drill 0.6)
  Top 0.254: S1.3 2.96,9.31 C4.1 2.96,7.34 3.8,6.5 4.8,6.5 5.1,6.2 5.1,5.32 J1.VBUS 5,5.21 5,4.2 4.3,3.5 v4.3,1.1 | v7.6,32.1 9.32,32.1 U$1.7 | J7.4 62.68,7.98 61.1,6.4 61.1,1.7 v60.8,1.4
  Bottom 0.254: S1.3 4.47,11.43 1.1,14.8 1.1,21.2 3.2,23.3 5.7,23.3 6.8,24.4 6.8,26.1 7.6,26.9 8,26.9 8.7,27.6 8.7,31 v7.6,32.1 | v60.8,1.4 19.2,1.4 18.3,0.5 4.9,0.5 v4.3,1.1
VIN
  Top 0.254: J3.1 13.79,9.41 11.7,11.5 10.23,11.5 S1.1
  Bottom 0.254: J3.1 13.79,2.79 15,4 27.6,4 29.2,2.4 62.2,2.4 63.3,3.5 63.3,5.14 J7.5
VOUT  (via drill 0.6)
  Top 0.254: v15.5,13.5 17.5,13.7 19.7,15.9 21,15.9 22.5,14.4 32,14.4 33.9,16.3 v33.9,22 | K2.1 44.91,24.09 47.6,21.4 57.4,21.4 v60.3,18.5
  Bottom 0.254: S1.2 7.62,12.02 10.5,14.9 11.82,14.9 U1.1 15.3,15.52 C17.1 C18.1 17.46,15.66 v15.5,13.5 | D1.C K1.1 43.2,32 43.2,31.3 39.61,27.71 K2.1 39.51,23.99 D2.C 34.11,22 v33.9,22 | v60.3,18.5 60.3,11.5 61.4,10.4 62.88,10.4 J7.3

### Text on the board
tPlace: Reset | Reset | Test | Port | Gnd | USB | Vin | 3.3V | Vout | V_USB | + | - | Vin
bPlace: HEEP I/O | HEEP I/O